# Altium project PR003.PrjPcb (part 3 of 11)

## Sheet M.2_M_NVMe.SchDoc
size A3; SheetNumber: 7; SheetTotal: 16
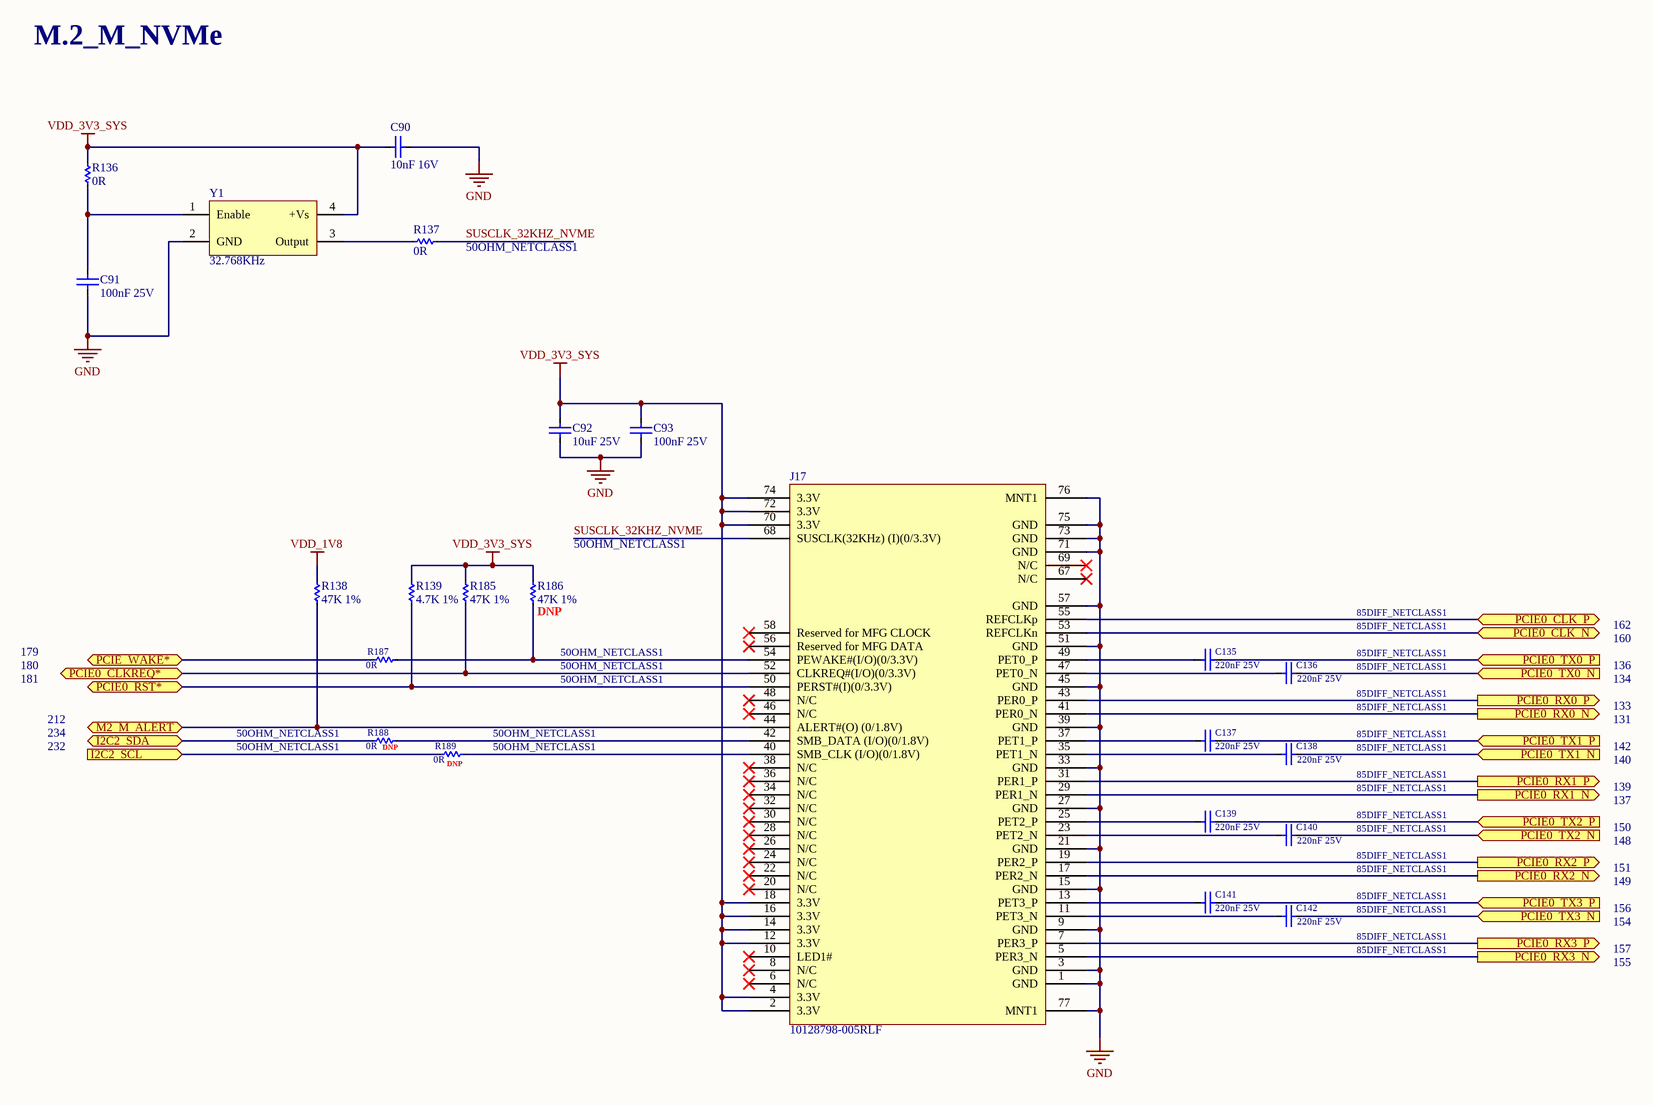
[diagram p5: M.2_M_NVMe.SchDoc]

### Parts
C90  10nF 16V  [C0402]
C91  100nF 25V  [C0402]
C92  10uF 25V  [C0805]
C93  100nF 25V  [C0402]
C135  220nF 25V  [C0402]
C136  220nF 25V  [C0402]
C137  220nF 25V  [C0402]
C138  220nF 25V  [C0402]
C139  220nF 25V  [C0402]
C140  220nF 25V  [C0402]
C141  220nF 25V  [C0402]
C142  220nF 25V  [C0402]
J17  10128798-005RLF  [10128798-005RLF]
R136  0R  [R0603]
R137  0R  [R0603]
R138  47K 1%  [R0402]
R139  4.7K 1%  [R0402]
R185  47K 1%  [R0402]
R186  47K 1%  [R0402]
R187  0R  [R0603]
R188  0R  [R0603]
R189  0R  [R0603]
Y1  32.768KHz  [D2SX003270004E]

### Ports
I2C2_SCL (in), I2C2_SDA (bidir), M2_M_ALERT (bidir), PCIE0_CLK_N (bidir), PCIE0_CLK_P (bidir), PCIE0_CLKREQ* (bidir), PCIE0_RST* (bidir), PCIE0_RX0_N (out), PCIE0_RX0_P (out), PCIE0_RX1_N (out), PCIE0_RX1_P (out), PCIE0_RX2_N (out), PCIE0_RX2_P (out), PCIE0_RX3_N (out), PCIE0_RX3_P (out), PCIE0_TX0_N (in), PCIE0_TX0_P (in), PCIE0_TX1_N (in), PCIE0_TX1_P (in), PCIE0_TX2_N (in), PCIE0_TX2_P (in), PCIE0_TX3_N (in), PCIE0_TX3_P (in), PCIE_WAKE* (bidir)

### Nets
GND: C90.2 C91.1 C92.1 C93.1 J17.1(GND) J17.3(GND) J17.9(GND) J17.15(GND) J17.21(GND) J17.27(GND) J17.33(GND) J17.39(GND) J17.45(GND) J17.51(GND) J17.57(GND) J17.71(GND) J17.73(GND) J17.75(GND) J17.76(MNT1) J17.77(MNT1) Y1.2(GND)
VDD_1V8: R138.2
VDD_3V3_SYS: C90.1 C92.2 C93.2 J17.2(3.3V) J17.4(3.3V) J17.12(3.3V) J17.14(3.3V) J17.16(3.3V) J17.18(3.3V) J17.70(3.3V) J17.72(3.3V) J17.74(3.3V) R136.2 R139.2 R185.2 R186.2 Y1.4(+Vs)
I2C2_SCL: R189.2 ; port I2C2_SCL
I2C2_SDA: R188.2 ; port I2C2_SDA
M2_M_ALERT: J17.44(ALERT#(O)_(0/1.8V)) R138.1 ; port M2_M_ALERT
SUSCLK_32KHZ_NVME: J17.68(SUSCLK(32KHz)_(I)(0/3.3V)) R137.1
NetC91_2: C91.2 R136.1 Y1.1(Enable)
NetC135_1: C135.1 J17.49(PET0_P)
NetC135_2: C135.2 ; port PCIE0_TX0_P
NetC136_1: C136.1 J17.47(PET0_N)
NetC136_2: C136.2 ; port PCIE0_TX0_N
NetC137_1: C137.1 J17.37(PET1_P)
NetC137_2: C137.2 ; port PCIE0_TX1_P
NetC138_1: C138.1 J17.35(PET1_N)
NetC138_2: C138.2 ; port PCIE0_TX1_N
NetC139_1: C139.1 J17.25(PET2_P)
NetC139_2: C139.2 ; port PCIE0_TX2_P
NetC140_1: C140.1 J17.23(PET2_N)
NetC140_2: C140.2 ; port PCIE0_TX2_N
NetC141_1: C141.1 J17.13(PET3_P)
NetC141_2: C141.2 ; port PCIE0_TX3_P
NetC142_1: C142.1 J17.11(PET3_N)
NetC142_2: C142.2 ; port PCIE0_TX3_N
NetJ10_131: J17.41(PER0_N) ; port PCIE0_RX0_N
NetJ10_133: J17.43(PER0_P) ; port PCIE0_RX0_P
NetJ10_137: J17.29(PER1_N) ; port PCIE0_RX1_N
NetJ10_139: J17.31(PER1_P) ; port PCIE0_RX1_P
NetJ10_149: J17.17(PER2_N) ; port PCIE0_RX2_N
NetJ10_151: J17.19(PER2_P) ; port PCIE0_RX2_P
NetJ10_155: J17.5(PER3_N) ; port PCIE0_RX3_N
NetJ10_157: J17.7(PER3_P) ; port PCIE0_RX3_P
NetJ10_160: J17.53(REFCLKn) ; port PCIE0_CLK_N
NetJ10_162: J17.55(REFCLKp) ; port PCIE0_CLK_P
NetJ10_179: R187.2 ; port PCIE_WAKE*
NetJ10_180: J17.52(CLKREQ#(I/O)(0/3.3V)) R185.1 ; port PCIE0_CLKREQ*
NetJ10_181: J17.50(PERST#(I)(0/3.3V)) R139.1 ; port PCIE0_RST*
NetJ17_40: J17.40(SMB_CLK_(I/O)(0/1.8V)) R189.1
NetJ17_42: J17.42(SMB_DATA_(I/O)(0/1.8V)) R188.1
NetJ17_54: J17.54(PEWAKE#(I/O)(0/3.3V)) R186.1 R187.1
NetR137_2: R137.2 Y1.3(Output)

Not connected (* = marked no-connect by the designer): J17 6(N/C)* 8(N/C)* 10(LED1#)* 20(N/C)* 22(N/C)* 24(N/C)* 26(N/C)* 28(N/C)* 30(N/C)* 32(N/C)* 34(N/C)* 36(N/C)* 38(N/C)* 46(N/C)* 48(N/C)* 56(Reserved_for_MFG_DATA)* 58(Reserved_for_MFG_CLOCK)* 67(N/C)* 69(N/C)*

### Notes on the sheet
- M.2_M_NVMe
- (near R137) 50OHM_NETCLASS1
- (near R186) 50OHM_NETCLASS1
- 180
- 179
- (near R186) DNP
- 50OHM_NETCLASS1
- 85DIFF_NETCLASS1
- 160
- 162
- 136
- 181
- 234
- 212
- (near R189) 50OHM_NETCLASS1
- 134
- 131
- 133
- 232
- (near R188) DNP
- (near R189) DNP
- 140
- 142
- 137
- 139
- 148
- 150
- 151
- 149
- 154
- 156
- 155
- 157

### Library data of the parts
C90 = 0402YC103KAT2A: Cap Ceramic 0.01uF 16V X7R 10% SMD 0402 125°C Paper T/R; Manufacturer: Kyocera AVX; Insulation Resistance: 100GR; Supplier 1: Digi-Key; Manufacturer Part Number: 0402YC103KAT2A; RoHS: Yes; Category: Ceramic Capacitors; Stock 1: 3405577; Pricing 1: 1=0.10000, 10=0.01300, 50=0.00720, 100=0.00590, 500=0.00424, 1000=0.00333, 2500=0.00303, 5000=0.00279 (USD); Mount: Surface Mount; Case/Package: 0402; Case Code (Imperial): 0402; Case Code (Metric): 1005; Contact Plating: Tin,Matte; Min Operating Temperature: -55°C; Max Operating Temperature: 125°C; Capacitance: 10nF; Tolerance: 10%; Voltage Rating (DC): 16V; Packaging: Tape and Reel; Dielectric: X7R; Voltage: 16V; Voltage Rating: 16V; Package Quantity: 10000; Termination: SMD/SMT; Series: -; Construction: Flat; Length: 1mm; Width: 0.5mm; Height: 0.5mm; Thickness: 0.022inch; Depth: 0.5mm; Radiation Hardening: No; Reach SVHC Compliant: Yes; Lead Free: Lead Free; RoHS Compliant: Yes; ComponentLink1URL: https://datasheet.ciiva.com/11788/0900766b80dc2409-11788541.pdf?src-supplier=RSComponents; ComponentLink1Description: https://datasheet.ciiva.com/11788/0900766b80dc2409-11788541.pdf?src-supplier=RSComponents; ComponentLink2URL: https://datasheet.ciiva.com/2987/cx7r-2987704.pdf?src-supplier=Avnet; ComponentLink2Description: https://datasheet.ciiva.com/2987/cx7r-2987704.pdf?src-supplier=Avnet; ComponentLink3URL: https://datasheet.ciiva.com/16290/cx7r-16290154.pdf?src-supplier=Future+Electronics; ComponentLink3Description: https://datasheet.ciiva.com/16290/cx7r-16290154.pdf?src-supplier=Future+Electronics; ComponentLink4URL: https://datasheet.ciiva.com/15212/getdatasheetpartid-110062-15212107.pdf?src-supplier=Verical; ComponentLink4Description: https://datasheet.ciiva.com/15212/getdatasheetpartid-110062-15212107.pdf?src-supplier=Verical; ComponentLink5URL: https://datasheet.ciiva.com/1123/319609-1123955.pdf?src-supplier=Element14; ComponentLink5Description: https://datasheet.ciiva.com/1123/319609-1123955.pdf?src-supplier=Element14; ComponentLink6URL: https://datasheet.ciiva.com/1123/319609-1123954.pdf?src-supplier=Element14; ComponentLink6Description: https://datasheet.ciiva.com/1123/319609-1123954.pdf?src-supplier=Element14; ComponentLink7URL: https://datasheet.ciiva.com/7709/683218-7709771.pdf?src-supplier=Element14; ComponentLink7Description: https://datasheet.ciiva.com/7709/683218-7709771.pdf?src-supplier=Element14; ComponentLink8URL: https://datasheet.ciiva.com/22749/683218-22749625.pdf?src-supplier=Element14; ComponentLink8Description: https://datasheet.ciiva.com/22749/683218-22749625.pdf?src-supplier=Element14; ComponentLink9URL: https://datasheet.ciiva.com/150/cx7r-150222.pdf?src-supplier=Digi-Key; ComponentLink9Description: https://datasheet.ciiva.com/150/cx7r-150222.pdf?src-supplier=Digi-Key; ComponentLink10URL: https://datasheet.ciiva.com/150/cx7r-150221.pdf?src-supplier=Digi-Key; ComponentLink10Description: https://datasheet.ciiva.com/150/cx7r-150221.pdf?src-supplier=Digi-Key; ComponentLink11URL: https://datasheet.ciiva.com/150/cx7r-150223.pdf?src-supplier=Digi-Key; ComponentLink11Description: https://datasheet.ciiva.com/150/cx7r-150223.pdf?src-supplier=Digi-Key; ComponentLink12URL: https://datasheet.ciiva.com/5417/cx7r-218113-5417068.pdf?src-supplier=Mouser; ComponentLink12Description: https://datasheet.ciiva.com/5417/cx7r-218113-5417068.pdf?src-supplier=Mouser; ComponentLink13URL: https://datasheet.ciiva.com/14596/70001075-14596855.pdf?src-supplier=Allied+Electronics; ComponentLink13Description: https://datasheet.ciiva.com/14596/70001075-14596855.pdf?src-supplier=Allied+Electronics; Supplier Part Number 1: 478-1114-1-ND
C91 C93 = TMK105BJ104KV-F: as C123 on sheet Block_HDMI, DP, DSI, USBSS and PCIe; Supplier 1: Digi-Key; Manufacturer Part Number: TMK105BJ104KV-F; RoHS: Yes; Category: Ceramic Capacitors; Stock 1: 11997960; Pricing 1: 1=0.10000, 10=0.03700, 50=0.02000, 100=0.01630, 500=0.01166, 1000=0.00917, 2500=0.00833, 5000=0.00767 (USD); Mount: Surface Mount; Case/Package: 0402; Number of Pins: 2; Case Code (Imperial): 0402; Case Code (Metric): 1005; Weight: 2.3E-05oz; Min Operating Temperature: -55°C; Max Operating Temperature: 85°C; Capacitance: 100nF; Packaging: Tape and Reel; Dielectric: X5R; Voltage Rating (DC): 25V; Voltage Rating: 25V; Package Quantity: 1; Termination: SMD/SMT; Resistor Type: Ceramic; Voltage: 25V; Series: M; Construction: Flat; Length: 1mm; Width: 0.02inch; Height: 0.5mm; Depth: 0.5mm; Thickness: 0.022inch; Reach SVHC Compliant: Yes; Lead Free: Lead Free; Halogen Free: Halogen Free; RoHS Compliant: Yes; Supplier Part Number 1: 587-1456-1-ND
C92 = TMK212BBJ106KG-T: 0805 10 uF 25 V ±10% Tolerance X5R SMT Multilayer Ceramic Capacitor; Manufacturer: Taiyo Yuden; Dielectric: X7R; Voltage: 16V; Supplier 1: Digi-Key; Manufacturer Part Number: TMK212BBJ106KG-T; RoHS: Yes; Category: Ceramic Capacitors; Stock 1: 3515248; Pricing 1: 1=0.18000, 10=0.12400, 50=0.07460, 100=0.06290, 500=0.04306, 1000=0.03810 (USD); Mount: Surface Mount; Case/Package: 0805; Number of Pins: 2; Case Code (Metric): 2012; Case Code (Imperial): 0805; Min Operating Temperature: -55°C; Max Operating Temperature: 85°C; Capacitance: 10uF; Tolerance: 10%; Packaging: Tape and Reel; Voltage Rating (DC): 25V; Package Quantity: 1; Voltage Rating: 25V; Termination: SMD/SMT; Resistor Type: Ceramic; Series: M; Length: 0.079inch; Width: 0.049inch; Height: 1.25mm; Thickness: 0.053inch; Lead Free: Lead Free; Reach SVHC Compliant: Yes; RoHS Compliant: Yes; ComponentLink1URL: https://datasheet.ciiva.com/30062/tmk212bbj106kg-t-30062083.pdf?src-supplier=Onlinecomponents.com; ComponentLink1Description: https://datasheet.ciiva.com/30062/tmk212bbj106kg-t-30062083.pdf?src-supplier=Onlinecomponents.com; ComponentLink2URL: https://datasheet.ciiva.com/7975/1481447-7975820.pdf?src-supplier=Element14; ComponentLink2Description: https://datasheet.ciiva.com/7975/1481447-7975820.pdf?src-supplier=Element14; ComponentLink3URL: https://datasheet.ciiva.com/139/mlcc-all-e-139571.pdf?src-supplier=Digi-Key; ComponentLink3Description: https://datasheet.ciiva.com/139/mlcc-all-e-139571.pdf?src-supplier=Digi-Key; ComponentLink4URL: https://datasheet.ciiva.com/139/mlcc-all-e-139570.pdf?src-supplier=Digi-Key; ComponentLink4Description: https://datasheet.ciiva.com/139/mlcc-all-e-139570.pdf?src-supplier=Digi-Key; ComponentLink5URL: https://datasheet.ciiva.com/139/mlcc-all-e-139572.pdf?src-supplier=Digi-Key; ComponentLink5Description: https://datasheet.ciiva.com/139/mlcc-all-e-139572.pdf?src-supplier=Digi-Key; Supplier Part Number 1: 587-2985-1-ND
C135-C142 = C0402C224M3RAC7867: Cap Cer 0402 220NF 25VDC X7R; Manufacturer: KEMET; Supplier 1: Digi-Key; Manufacturer Part Number: C0402C224M3RAC7867; RoHS: Yes; Category: Ceramic Capacitors; Stock 1: 41499; Pricing 1: 1=0.46000, 10=0.31800, 50=0.22240, 100=0.19060, 500=0.14294, 1000=0.12071, 2500=0.11435, 5000=0.10800 (USD); Supplier Part Number 1: 399-C0402C224M3RAC7867CT-ND
J17 = 10128798-005RLF: PCIe M.2 Connectors, Storage and Server Connector, P=0.5mm, H5.5mm, Key M, 30u" Au Plating; Manufacturer: Amphenol Communications Solutions; Supplier 1: Digi-Key; Manufacturer Part Number: 10128798-005RLF; RoHS: No; Category: Card Edge Connectors; Stock 1: 8100; Pricing 1: 900=1.89567, 1800=1.71221, 2700=1.65106 (USD); Supplier Part Number 1: 10128798-005RLF-ND
R136 R137 R187-R189 = CR0603-J/-000ELF: as R141 on sheet TypeC_USB2.0; Supplier 1: Digi-Key; Manufacturer Part Number: CR0603-J/-000ELF; RoHS: Yes; Category: Chip SMD Resistors; Stock 1: 1690954; Pricing 1: 1=0.10000, 10=0.01300, 25=0.00960, 50=0.00720, 100=0.00540, 250=0.00408, 500=0.00328, 1000=0.00241 (USD); Mount: Surface Mount; Case/Package: 0603; Number of Pins: 2; Case Code (Imperial): 0603; Case Code (Metric): 1608; Contact Plating: Tin; Min Operating Temperature: -55°C; Max Operating Temperature: 155°C; Packaging: Tape and Reel; Package Quantity: 5000; Resistor Type: Thick Film; Termination: SMD/SMT; Max Power Dissipation: 100mW; Voltage Rating (DC): 50V; Series: CR0603; Technology: THICK FILM; Construction: Rectangular; Features: Moisture Resistant; Number of Terminations: 2; Length: 1.6mm; Width: 0.8mm; Height: 0.45mm; Depth: 0.8mm; Thickness: 457um; Radiation Hardening: No; Reach SVHC Compliant: Yes; Military Standard: Not; RoHS Compliant: Yes; ComponentLink1URL: https://datasheet.ciiva.com/11809/0900766b80fcdb72-11809586.pdf?src-supplier=RSComponents; ComponentLink1Description: https://datasheet.ciiva.com/11809/0900766b80fcdb72-11809586.pdf?src-supplier=RSComponents; ComponentLink2URL: https://datasheet.ciiva.com/7001/1902866-7001645.pdf?src-supplier=Newark; ComponentLink2Description: https://datasheet.ciiva.com/7001/1902866-7001645.pdf?src-supplier=Newark; ComponentLink3URL: https://datasheet.ciiva.com/7986/691949-7986171.pdf?src-supplier=Element14; ComponentLink3Description: https://datasheet.ciiva.com/7986/691949-7986171.pdf?src-supplier=Element14; ComponentLink4URL: https://datasheet.ciiva.com/7660/1856384-7660956.pdf?src-supplier=Element14; ComponentLink4Description: https://datasheet.ciiva.com/7660/1856384-7660956.pdf?src-supplier=Element14; ComponentLink5URL: https://datasheet.ciiva.com/22693/1902866-22693213.pdf?src-supplier=Element14; ComponentLink5Description: https://datasheet.ciiva.com/22693/1902866-22693213.pdf?src-supplier=Element14; ComponentLink6URL: https://datasheet.ciiva.com/5545/chpreztr-5545708.pdf?src-supplier=Mouser; ComponentLink6Description: https://datasheet.ciiva.com/5545/chpreztr-5545708.pdf?src-supplier=Mouser; ComponentLink7URL: https://datasheet.ciiva.com/16761/70154685-16761515.pdf?src-supplier=Allied+Electronics; ComponentLink7Description: https://datasheet.ciiva.com/16761/70154685-16761515.pdf?src-supplier=Allied+Electronics; ComponentLink8URL: https://datasheet.ciiva.com/30062/159chpreztr-30062601.pdf?src-supplier=Onlinecomponents.com; ComponentLink8Description: https://datasheet.ciiva.com/30062/159chpreztr-30062601.pdf?src-supplier=Onlinecomponents.com; ComponentLink9URL: https://datasheet.ciiva.com/48692/001055497-da-01-en-smd-wid-cr0603-j-000elf-0-0-ohm-1-10w-48692135.pdf?src-supplier=Conrad; ComponentLink9Description: https://datasheet.ciiva.com/48692/001055497-da-01-en-smd-wid-cr0603-j-000elf-0-0-ohm-1-10w-48692135.pdf?src-supplier=Conrad; Supplier Part Number 1: CR0603-J/-000ELFCT-ND
R138 R185 R186 = RC0402FR-0747KL: Res General Purpose Thick Film 0402 47K Ohm 1% 1/16W ±100ppm/°C Molded SMD Paper T/R; Manufacturer: Yageo; Power Rating: 62.5mW; Voltage Rating: 50V; Resistance: 47kR; Max Power Dissipation: 63mW; Supplier 1: Digi-Key; Manufacturer Part Number: RC0402FR-0747KL; RoHS: Yes; Category: Chip SMD Resistors; Stock 1: 5550475; Pricing 1: 1=0.10000, 10=0.01400, 100=0.00580, 1000=0.00262, 2500=0.00228, 5000=0.00188 (USD); Case/Package: 0402; Case Code (Imperial): 0402; Case Code (Metric): 1005; Size Code: 0402; Min Operating Temperature: -55°C; Max Operating Temperature: 155°C; Tolerance: 1%; Packaging: Tape and Reel; Package Quantity: 1; Termination: SMD/SMT; Resistor Type: Thick Film; Number of Terminations: 2; Temperature Coefficient: 100ppm/°C; Features: Moisture Resistant; Series: RC; Resistance Tolerance: 1%; Construction: Rectangular; Length: 1mm; Width: 0.02inch; Height: 0.016inch; Depth: 0.5mm; Military Standard: Not; Lead Free: Lead Free; RoHS Compliant: Yes; ComponentLink1URL: https://datasheet.ciiva.com/46412/1018594-46412839.pdf?src-supplier=Element14; ComponentLink1Description: https://datasheet.ciiva.com/46412/1018594-46412839.pdf?src-supplier=Element14; ComponentLink2URL: https://datasheet.ciiva.com/2453/pyu-r-int-thick-7-2453389.pdf?src-supplier=Digi-Key; ComponentLink2Description: https://datasheet.ciiva.com/2453/pyu-r-int-thick-7-2453389.pdf?src-supplier=Digi-Key; ComponentLink3URL: https://datasheet.ciiva.com/2453/pyu-r-int-thick-7-2453390.pdf?src-supplier=Digi-Key; ComponentLink3Description: https://datasheet.ciiva.com/2453/pyu-r-int-thick-7-2453390.pdf?src-supplier=Digi-Key; ComponentLink4URL: https://datasheet.ciiva.com/2453/pyu-r-int-thick-7-2453388.pdf?src-supplier=Digi-Key; ComponentLink4Description: https://datasheet.ciiva.com/2453/pyu-r-int-thick-7-2453388.pdf?src-supplier=Digi-Key; ComponentLink5URL: https://datasheet.ciiva.com/15189/getdatasheetpartid-323748-15189466.pdf?src-supplier=Verical; ComponentLink5Description: https://datasheet.ciiva.com/15189/getdatasheetpartid-323748-15189466.pdf?src-supplier=Verical; ComponentLink6URL: https://datasheet.ciiva.com/16793/pyu-rc0402-51-rohs-l-6-r-16793430.pdf?src-supplier=Future+Electronics; ComponentLink6Description: https://datasheet.ciiva.com/16793/pyu-rc0402-51-rohs-l-6-r-16793430.pdf?src-supplier=Future+Electronics; Supplier Part Number 1: 311-47.0KLRCT-ND
R139 = RC0402FR-074K7L: YAGEO (PHYCOMP) - RC0402FR-074K7L - RES, THICK FILM, 4K7, 1%, 0.063W, 0402; Voltage Rating (DC): 50V; Power Rating: 62.5mW; Resistance: 4.7kR; Temperature Coefficient: 100ppm/°C; Max Power Dissipation: 63mW; Supplier 1: Digi-Key; Manufacturer: Yageo; Manufacturer Part Number: RC0402FR-074K7L; RoHS: Yes; Category: Chip SMD Resistors; Stock 1: 22298998; Pricing 1: 1=0.10000, 10=0.01400, 100=0.00580, 1000=0.00262, 2500=0.00228, 5000=0.00188 (USD); Case/Package: 0402; Number of Pins: 2; Case Code (Imperial): 0402; Case Code (Metric): 1005; Size Code: 0402; Min Operating Temperature: -55°C; Max Operating Temperature: 155°C; Tolerance: 1%; Voltage Rating: 50V; Packaging: Tape and Reel; Resistor Type: Thick Film; Termination: SMD/SMT; Features: Moisture Resistant; Series: RC; Number of Terminations: 2; Resistance Tolerance: 1%; Construction: Rectangular; Length: 1mm; Width: 0.5mm; Height: 0.32mm; Depth: 0.5mm; Height - Seated (Max): 0.016inch; Reach SVHC Compliant: Yes; Military Standard: Not; Lead Free: Lead Free; RoHS Compliant: Yes; ComponentLink1URL: https://datasheet.ciiva.com/22661/1686128-22661342.pdf?src-supplier=Element14; ComponentLink1Description: https://datasheet.ciiva.com/22661/1686128-22661342.pdf?src-supplier=Element14; ComponentLink2URL: https://datasheet.ciiva.com/7850/1018594-7850022.pdf?src-supplier=Element14; ComponentLink2Description: https://datasheet.ciiva.com/7850/1018594-7850022.pdf?src-supplier=Element14; ComponentLink3URL: https://datasheet.ciiva.com/7850/1018594-7850023.pdf?src-supplier=Element14; ComponentLink3Description: https://datasheet.ciiva.com/7850/1018594-7850023.pdf?src-supplier=Element14; ComponentLink4URL: https://datasheet.ciiva.com/15215/getdatasheetpartid-328119-15215035.pdf?src-supplier=Verical; ComponentLink4Description: https://datasheet.ciiva.com/15215/getdatasheetpartid-328119-15215035.pdf?src-supplier=Verical; Supplier Part Number 1: 311-4.7KLRCT-ND
Y1 = D2SX003270004E: Osc 2520 32.768KHZ Cmos; Manufacturer: Hosonic Electronic; Supplier 1: Digi-Key; Manufacturer Part Number: D2SX003270004E; RoHS: No; Category: Oscillators; Stock 1: 770; Pricing 1: 1=1.48000, 10=1.41100, 50=1.37860, 100=1.18170, 500=1.14888, 1000=0.96834 (USD); Supplier Part Number 1: 3186-D2SX003270004ECT-ND

## Sheet Ethernet.SchDoc
size A3; SheetNumber: 8; SheetTotal: 16
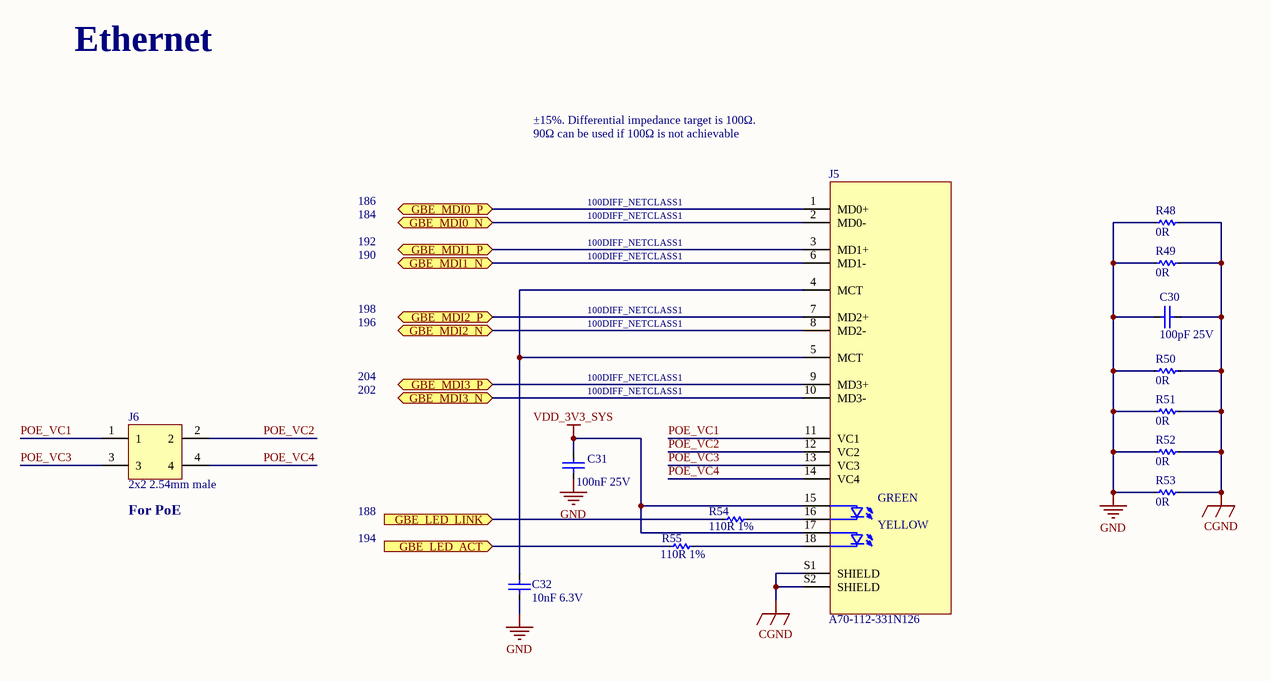
[diagram p6: Ethernet.SchDoc]

### Parts
C30  100pF 25V  [C0402]
C31  100nF 25V  [C0402]
C32  10nF 6.3V  [C0402]
J5  A70-112-331N126  [A70-112-331N126]
J6  2x2 2.54mm male  [PEC02DABN]
R48  0R  [R0603]
R49  0R  [R0603]
R50  0R  [R0603]
R51  0R  [R0603]
R52  0R  [R0603]
R53  0R  [R0603]
R54  110R 1%  [R0402]
R55  110R 1%  [R0402]

### Ports
GBE_LED_ACT (in), GBE_LED_LINK (in), GBE_MDI0_N (bidir), GBE_MDI0_P (bidir), GBE_MDI1_N (bidir), GBE_MDI1_P (bidir), GBE_MDI2_N (bidir), GBE_MDI2_P (bidir), GBE_MDI3_N (bidir), GBE_MDI3_P (bidir)

### Nets
CGND: C30.2 J5.S1(SHIELD) J5.S2(SHIELD) R48.2 R49.2 R50.2 R51.2 R52.2 R53.2
GND: C30.1 C31.1 C32.1 R48.1 R49.1 R50.1 R51.1 R52.1 R53.1
VDD_3V3_SYS: C31.2 J5.15(G_A) J5.17(Y_A)
POE_VC1: J5.11(VC1) J6.1
POE_VC2: J5.12(VC2) J6.2
POE_VC3: J5.13(VC3) J6.3
POE_VC4: J5.14(VC4) J6.4
NetC32_2: C32.2 J5.4(MCT) J5.5(MCT)
NetJ5_1: J5.1(MD0+) ; port GBE_MDI0_P
NetJ5_2: J5.2(MD0-) ; port GBE_MDI0_N
NetJ5_3: J5.3(MD1+) ; port GBE_MDI1_P
NetJ5_6: J5.6(MD1-) ; port GBE_MDI1_N
NetJ5_7: J5.7(MD2+) ; port GBE_MDI2_P
NetJ5_8: J5.8(MD2-) ; port GBE_MDI2_N
NetJ5_9: J5.9(MD3+) ; port GBE_MDI3_P
NetJ5_10: J5.10(MD3-) ; port GBE_MDI3_N
NetJ5_16: J5.16(G_K) R54.2
NetJ5_18: J5.18(Y_K) R55.2
NetJ10_188: R54.1 ; port GBE_LED_LINK
NetJ10_194: R55.1 ; port GBE_LED_ACT

### Notes on the sheet
- Ethernet
- ±15%. Differential impedance target is 100Ω.
- 90Ω can be used if 100Ω is not achievable
- 186
- 184
- 100DIFF_NETCLASS1
- 192
- 190
- 198
- 196
- 204
- 202
- (near J6) For PoE
- 188
- 194
- (in symbol A70-112-331N126) GREEN; YELLOW

### Library data of the parts
C30 = C0402C101J3GACTU: Cap Ceramic 100pF 25V C0G 5% SMD 0402 125C Paper T/R; Manufacturer: KEMET; Temperature Coefficient: 30ppm/°C; Dissipation Factor: 0.1%; Supplier 1: Digi-Key; Manufacturer Part Number: C0402C101J3GACTU; RoHS: Yes; Category: Ceramic Capacitors; Stock 1: 6224680; Pricing 1: 1=0.10000, 10=0.03100, 50=0.01700, 100=0.01390, 500=0.00990, 1000=0.00778, 2500=0.00707, 5000=0.00650 (USD); Mount: Surface Mount; Case/Package: 0402; Number of Pins: 2; Contact Plating: Tin,Matte; Dielectric Material: Ceramic; Case Code (Imperial): 0402; Case Code (Metric): 1005; Min Operating Temperature: -55°C; Max Operating Temperature: 125°C; Capacitance: 100pF; Tolerance: 5%; Packaging: Tape and Reel; Dielectric: C0G; Voltage Rating (DC): 25V; Package Quantity: 1; Voltage Rating: 25V; Termination: SMD/SMT; Voltage: 25V; Series: C0402C; Length: 1mm; Width: 0.02inch; Height: 0.5mm; Depth: 0.5mm; Thickness: 0.022inch; Lead Pitch: 0.3mm; Radiation Hardening: No; Lead Free: Lead Free; Reach SVHC Compliant: Yes; RoHS Compliant: Yes; ComponentLink1URL: http://components.arrow.com/part/dataview/2084787S8438145N7429?src-supplier=Arrow+Electronics; ComponentLink1Description: http://components.arrow.com/part/dataview/2084787S8438145N7429?src-supplier=Arrow+Electronics; ComponentLink2URL: http://www.jameco.com/Jameco/Products/ProdDS/1635286.pdf?src-supplier=Jameco; ComponentLink2Description: http://www.jameco.com/Jameco/Products/ProdDS/1635286.pdf?src-supplier=Jameco; ComponentLink3URL: http://www.farnell.com/datasheets/2739832.pdf?src-supplier=Farnell; ComponentLink3Description: http://www.farnell.com/datasheets/2739832.pdf?src-supplier=Farnell; ComponentLink4URL: http://uk.rs-online.com/webdocs/1443/0900766b81443d93.pdf?src-supplier=RSComponents; ComponentLink4Description: http://uk.rs-online.com/webdocs/1443/0900766b81443d93.pdf?src-supplier=RSComponents; ComponentLink5URL: http://www.mouser.com/ds/2/212/KEM_C1003_C0G_SMD-1101588.pdf?src-supplier=Mouser; ComponentLink5Description: http://www.mouser.com/ds/2/212/KEM_C1003_C0G_SMD-1101588.pdf?src-supplier=Mouser; ComponentLink6URL: http://uk.rs-online.com/webdocs/1443/0900766b81443d94.pdf?src-supplier=RSComponents; ComponentLink6Description: http://uk.rs-online.com/webdocs/1443/0900766b81443d94.pdf?src-supplier=RSComponents; ComponentLink7URL: http://www.farnell.com/datasheets/2739832.pdf?src-supplier=Newark; ComponentLink7Description: http://www.farnell.com/datasheets/2739832.pdf?src-supplier=Newark; ComponentLink8URL: http://www.farnell.com/datasheets/2739832.pdf?src-supplier=Element14; ComponentLink8Description: http://www.farnell.com/datasheets/2739832.pdf?src-supplier=Element14; ComponentLink9URL: https://api.kemet.com/component-edge/download/datasheet/C0402C101J3GACTU.pdf?src-supplier=Digi-Key; ComponentLink9Description: https://api.kemet.com/component-edge/download/datasheet/C0402C101J3GACTU.pdf?src-supplier=Digi-Key; ComponentLink10URL: http://www.farnell.com/datasheets/1372242.pdf?src-supplier=Element14; ComponentLink10Description: http://www.farnell.com/datasheets/1372242.pdf?src-supplier=Element14; Supplier Part Number 1: 399-C0402C101J3GAC7867CT-ND
C31 = TMK105BJ104KV-F: as C123 on sheet Block_HDMI, DP, DSI, USBSS and PCIe; Supplier 1: Digi-Key; Manufacturer Part Number: TMK105BJ104KV-F; RoHS: Yes; Category: Ceramic Capacitors; Stock 1: 11997960; Pricing 1: 1=0.10000, 10=0.03700, 50=0.02000, 100=0.01630, 500=0.01166, 1000=0.00917, 2500=0.00833, 5000=0.00767 (USD); Mount: Surface Mount; Case/Package: 0402; Number of Pins: 2; Case Code (Imperial): 0402; Case Code (Metric): 1005; Weight: 2.3E-05oz; Min Operating Temperature: -55°C; Max Operating Temperature: 85°C; Capacitance: 100nF; Packaging: Tape and Reel; Dielectric: X5R; Voltage Rating (DC): 25V; Voltage Rating: 25V; Package Quantity: 1; Termination: SMD/SMT; Resistor Type: Ceramic; Voltage: 25V; Series: M; Construction: Flat; Length: 1mm; Width: 0.02inch; Height: 0.5mm; Depth: 0.5mm; Thickness: 0.022inch; Reach SVHC Compliant: Yes; Lead Free: Lead Free; Halogen Free: Halogen Free; RoHS Compliant: Yes; Supplier Part Number 1: 587-1456-1-ND
C32 = GRM155R60J103KA01D: 0402 10 nF 6.3V ±10% Tolerance X5R SMT Multilayer Ceramic Capacitor; Manufacturer: Murata; Supplier 1: Mouser; Manufacturer Part Number: GRM155R60J103KA01D; RoHS: Yes; Category: Ceramic Capacitors; Stock 1: 107154; Pricing 1: 1=0.10000, 10=0.01600, 50=0.01600, 100=0.01200, 1000=0.00700, 10000=0.00400 (USD); Mount: Surface Mount; Case/Package: 0402; Case Code (Metric): 1005; Case Code (Imperial): 0402; Min Operating Temperature: -55°C; Max Operating Temperature: 85°C; Capacitance: 10nF; Voltage Rating: 6.3V; Tolerance: 10%; Packaging: Tape and Reel; Voltage Rating (DC): 6.3V; Package Quantity: 10000; Dielectric: X5R; Termination: SMD/SMT; Voltage: 6.3V; Series: GRM; Construction: Flat; Length: 1mm; Width: 0.02inch; Height: 0.5mm; Thickness: 0.022inch; Depth: 0.5mm; Radiation Hardening: No; Lead Free: Lead Free; RoHS Compliant: Yes; ComponentLink1URL: https://datasheet.ciiva.com/5415/product-5415926.pdf?src-supplier=Mouser; ComponentLink1Description: https://datasheet.ciiva.com/5415/product-5415926.pdf?src-supplier=Mouser; ComponentLink2URL: https://datasheet.ciiva.com/6263/partnumbering-e-01-6263692.pdf?src-supplier=Digi-Key; ComponentLink2Description: https://datasheet.ciiva.com/6263/partnumbering-e-01-6263692.pdf?src-supplier=Digi-Key; ComponentLink3URL: https://datasheet.ciiva.com/6263/partnumbering-e-01-6263689.pdf?src-supplier=Digi-Key; ComponentLink3Description: https://datasheet.ciiva.com/6263/partnumbering-e-01-6263689.pdf?src-supplier=Digi-Key; ComponentLink4URL: https://datasheet.ciiva.com/6263/partnumbering-e-01-6263695.pdf?src-supplier=Digi-Key; ComponentLink4Description: https://datasheet.ciiva.com/6263/partnumbering-e-01-6263695.pdf?src-supplier=Digi-Key; ComponentLink5URL: https://datasheet.ciiva.com/11620/product-11620090.pdf?src-supplier=Avnet; ComponentLink5Description: https://datasheet.ciiva.com/11620/product-11620090.pdf?src-supplier=Avnet; Supplier Part Number 1: 81-GRM155R60J103KA1D
J5 = A70-112-331N126: RJ45 MAGNETIC JACK WITH LED; ComponentLink1Description: Datasheet; ComponentLink1URL: https://www.snapeda.com/parts/A70-112-331N126/EDAC/datasheet/
J6 = PEC02DABN: Conn Header Vert 4POS 2.54MM; Manufacturer: Sullins; Number of Positions: 4; Connector Type: Male Pin; Pitch: 0.1inch; Supplier 1: Digi-Key; Manufacturer Part Number: PEC02DABN; RoHS: Yes; Category: Headers and Wire Housings; Stock 1: 2337; Pricing 1: 1=0.34000, 10=0.32000, 25=0.27400, 50=0.23280, 100=0.22380, 250=0.20092, 500=0.19180 (USD); Mount: Through Hole; Housing Material: Plastic; Housing Color: Black; Contact Material: Bronze; Color: Black; Contact Plating: Tin; Package Quantity: 1; Termination: Solder; Gender: Male; Number of Contacts: 4; Number of Rows: 2; Packaging: Bulk; Length: 5.08mm; Width: 5.08mm; Height: 2.54mm; Row Spacing: 0.1inch; Contact Mating Length: 0.23inch; Lead Free: Lead Free; ComponentLink1URL: https://datasheet.ciiva.com/6888/pxcxxdxxn-dwg-6888889.pdf?src-supplier=Digi-Key; ComponentLink1Description: https://datasheet.ciiva.com/6888/pxcxxdxxn-dwg-6888889.pdf?src-supplier=Digi-Key; Supplier Part Number 1: S2022E-02-ND
R48-R53 = CR0603-J/-000ELF: as R141 on sheet TypeC_USB2.0; Supplier 1: Digi-Key; Manufacturer Part Number: CR0603-J/-000ELF; RoHS: Yes; Category: Chip SMD Resistors; Stock 1: 1690954; Pricing 1: 1=0.10000, 10=0.01300, 25=0.00960, 50=0.00720, 100=0.00540, 250=0.00408, 500=0.00328, 1000=0.00241 (USD); Mount: Surface Mount; Case/Package: 0603; Number of Pins: 2; Case Code (Imperial): 0603; Case Code (Metric): 1608; Contact Plating: Tin; Min Operating Temperature: -55°C; Max Operating Temperature: 155°C; Packaging: Tape and Reel; Package Quantity: 5000; Resistor Type: Thick Film; Termination: SMD/SMT; Max Power Dissipation: 100mW; Voltage Rating (DC): 50V; Series: CR0603; Technology: THICK FILM; Construction: Rectangular; Features: Moisture Resistant; Number of Terminations: 2; Length: 1.6mm; Width: 0.8mm; Height: 0.45mm; Depth: 0.8mm; Thickness: 457um; Radiation Hardening: No; Reach SVHC Compliant: Yes; Military Standard: Not; RoHS Compliant: Yes; ComponentLink1URL: https://datasheet.ciiva.com/11809/0900766b80fcdb72-11809586.pdf?src-supplier=RSComponents; ComponentLink1Description: https://datasheet.ciiva.com/11809/0900766b80fcdb72-11809586.pdf?src-supplier=RSComponents; ComponentLink2URL: https://datasheet.ciiva.com/7001/1902866-7001645.pdf?src-supplier=Newark; ComponentLink2Description: https://datasheet.ciiva.com/7001/1902866-7001645.pdf?src-supplier=Newark; ComponentLink3URL: https://datasheet.ciiva.com/7986/691949-7986171.pdf?src-supplier=Element14; ComponentLink3Description: https://datasheet.ciiva.com/7986/691949-7986171.pdf?src-supplier=Element14; ComponentLink4URL: https://datasheet.ciiva.com/7660/1856384-7660956.pdf?src-supplier=Element14; ComponentLink4Description: https://datasheet.ciiva.com/7660/1856384-7660956.pdf?src-supplier=Element14; ComponentLink5URL: https://datasheet.ciiva.com/22693/1902866-22693213.pdf?src-supplier=Element14; ComponentLink5Description: https://datasheet.ciiva.com/22693/1902866-22693213.pdf?src-supplier=Element14; ComponentLink6URL: https://datasheet.ciiva.com/5545/chpreztr-5545708.pdf?src-supplier=Mouser; ComponentLink6Description: https://datasheet.ciiva.com/5545/chpreztr-5545708.pdf?src-supplier=Mouser; ComponentLink7URL: https://datasheet.ciiva.com/16761/70154685-16761515.pdf?src-supplier=Allied+Electronics; ComponentLink7Description: https://datasheet.ciiva.com/16761/70154685-16761515.pdf?src-supplier=Allied+Electronics; ComponentLink8URL: https://datasheet.ciiva.com/30062/159chpreztr-30062601.pdf?src-supplier=Onlinecomponents.com; ComponentLink8Description: https://datasheet.ciiva.com/30062/159chpreztr-30062601.pdf?src-supplier=Onlinecomponents.com; ComponentLink9URL: https://datasheet.ciiva.com/48692/001055497-da-01-en-smd-wid-cr0603-j-000elf-0-0-ohm-1-10w-48692135.pdf?src-supplier=Conrad; ComponentLink9Description: https://datasheet.ciiva.com/48692/001055497-da-01-en-smd-wid-cr0603-j-000elf-0-0-ohm-1-10w-48692135.pdf?src-supplier=Conrad; Supplier Part Number 1: CR0603-J/-000ELFCT-ND
R54 R55 = RT0402FRE07110RL: High Precision-High Stability Chip Resistor Thin Film 0402 110Ohm 1% Paper T/R; Manufacturer: Yageo; Power Rating: 62.5mW; Voltage Rating (DC): 50V; Temperature Coefficient: 50ppm/°C; Supplier 1: Digi-Key; Manufacturer Part Number: RT0402FRE07110RL; RoHS: Yes; Category: Chip SMD Resistors; Stock 1: 11129; Pricing 1: 1=0.10000, 10=0.07300, 100=0.02970, 500=0.01814, 1000=0.01336, 2500=0.01159, 5000=0.00958 (USD); Case/Package: 0402; Case Code (Imperial): 0402; Case Code (Metric): 1005; Weight: 2.3E-05oz; Min Operating Temperature: -55°C; Max Operating Temperature: 155°C; Resistance: 110R; Packaging: Cut Tape; Tolerance: 1%; Voltage Rating: 50V; Series: RT; Technology: THIN FILM; Termination: SMD/SMT; Package Quantity: 10000; Length: 1mm; Width: 0.5mm; Height: 0.3mm; Lead Free: Lead Free; RoHS Compliant: Yes; ComponentLink1URL: http://www.yageo.com/documents/recent/PYu-RT_1-to-0.01_RoHS_L_9.pdf?src-supplier=Digi-Key; ComponentLink1Description: http://www.yageo.com/documents/recent/PYu-RT_1-to-0.01_RoHS_L_9.pdf?src-supplier=Digi-Key; Supplier Part Number 1: 13-RT0402FRE07110RLCT-ND